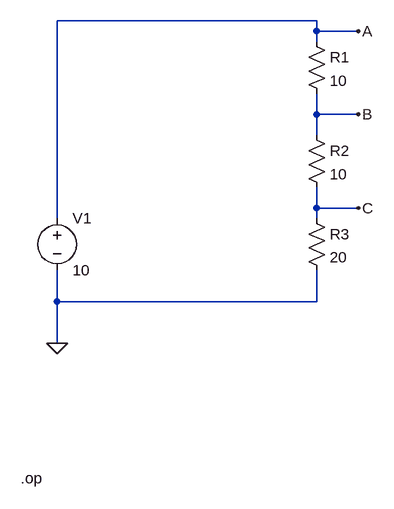
[diagram p0: schematic Series circuit.asc]
Series circuit.asc, the LTspice schematic file:
Version 4
SHEET 1 880 848
WIRE 384 128 -16 128
WIRE 384 144 384 128
WIRE 448 144 384 144
WIRE 384 160 384 144
WIRE 384 272 384 240
WIRE 448 272 384 272
WIRE 384 304 384 272
WIRE 384 416 384 384
WIRE 448 416 384 416
WIRE -16 432 -16 128
WIRE 384 432 384 416
WIRE -16 560 -16 512
WIRE 384 560 384 512
WIRE 384 560 -16 560
WIRE -16 624 -16 560
FLAG -16 624 0
FLAG 448 144 A
FLAG 448 272 B
FLAG 448 416 C
SYMBOL res 368 144 R0
SYMATTR InstName R1
SYMATTR Value 10
SYMBOL res 368 288 R0
SYMATTR InstName R2
SYMATTR Value 10
SYMBOL res 368 416 R0
SYMATTR InstName R3
SYMATTR Value 20
SYMBOL voltage -16 416 R0
SYMATTR InstName V1
SYMATTR Value 10
TEXT -72 832 Left 2 !.op

The netlist it stands for:
* Series circuit.asc
R1 A B 10
R2 B C 10
R3 C 0 20
V1 A 0 10
.op
.backanno
.end

* Results of the author's LTspice run, read from the files saved beside the schematic
* Operating Point:
*   V(a) = 10 V
*   V(b) = 7.5 V
*   V(c) = 5 V
*   I(R3) = 250 mA
*   I(R2) = 250 mA
*   I(R1) = 250 mA
*   I(V1) = -250 mA